# Altium project RTM_SFP.PrjPcb (part 1 of 2)
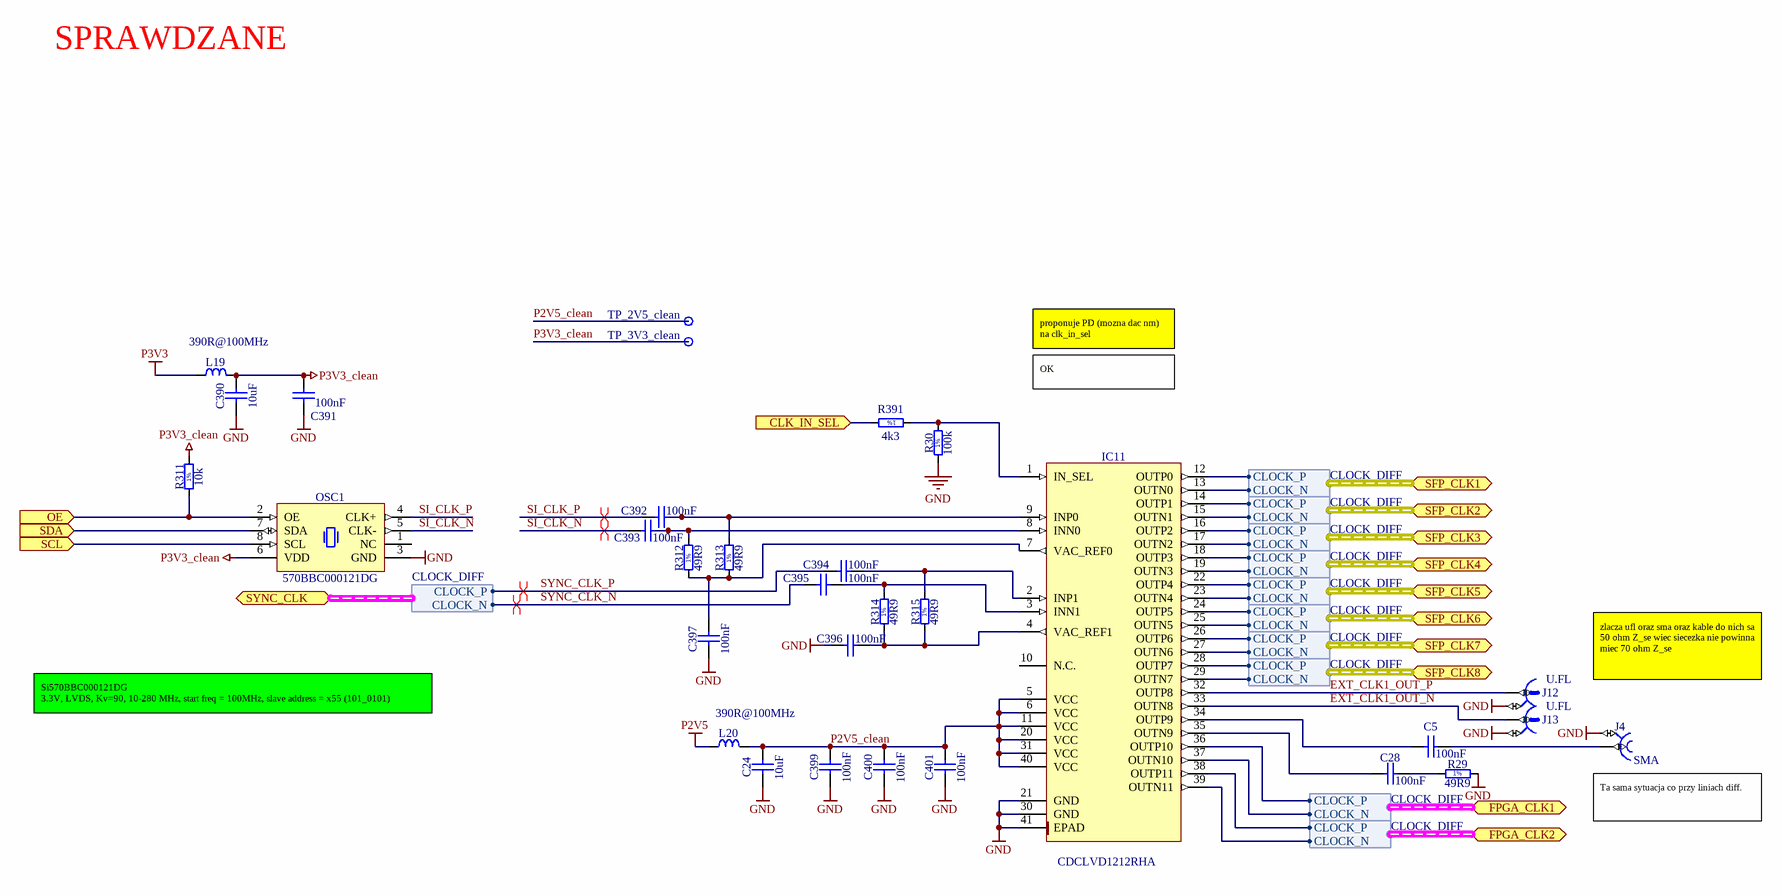
[diagram p0: Clock_Distribution.SchDoc]
7 sheets, 188 parts. Net scope: flat (ports and power ports of the same name join across sheets).
Board file: RTM_SFP.PcbDoc
Sheets:
  Clock_Distribution.SchDoc
  I2C_Switch.SchDoc
  PWR.SchDoc
  RTM_Connectors.SchDoc
  Serial_Registers.SchDoc
  SFP.SchDoc
  USR_IO_IPMI.SchDoc

## Sheet Clock_Distribution.SchDoc: Clock Distribution
size 420 x 297 mm; Organization: Altium Limited; Address1: L3, 12a Rodborough Rd; Address2: Frenchs Forest; Address3: NSW; Address4: Australia 2086; SheetNumber: 1; SheetTotal: 8

### Parts
C5  100nF  [CAPC1005X55N]
C24  10uF  [CAPC2012X135N]
C28  100nF  [CAPC1005X55N]
C390  10uF  [CAPC2012X135N]
C391  100nF  [CAPC0603X33N]
C392  100nF  [CAPC0603X33N]
C393  100nF  [CAPC0603X33N]
C394  100nF  [CAPC0603X33N]
C395  100nF  [CAPC0603X33N]
C396  100nF  [CAPC0603X33N]
C397  100nF  [CAPC0603X33N]
C399  100nF  [CAPC0603X33N]
C400  100nF  [CAPC0603X33N]
C401  100nF  [CAPC0603X33N]
IC11  CDCLVD1212RHA  [QFN50P600X600X80-41N-S425]
J4  SMA  [HUBER-SUHNER_85_SMA-50-0-101/111_NE]
J12  U.FL  [HIROSE_U.FL-R-SMT-1(10)]
J13  U.FL  [HIROSE_U.FL-R-SMT-1(10)]
L19  390R@100MHz  [INDC1608X95N]
L20  390R@100MHz  [INDC1608X95N]
OSC1  570BBC000121DG  [OSC_SILICON-LAB_SI570]
R29  49R9  [RESC1005X40N]
R30  100k  [RESC1608X55N]
R311  10k  [RESC1005X40N]
R312  49R9  [RESC1005X40N]
R313  49R9  [RESC1005X40N]
R314  49R9  [RESC1005X40N]
R315  49R9  [RESC1005X40N]
R391  4k3  [RESC1608X55N]
TP_2V5_clean  Test Point  [TPS127]  (value not drawn)
TP_3V3_clean  Test Point  [TPS127]  (value not drawn)

### Ports
CLK_IN_SEL (in), FPGA_CLK1 (harness CLOCK_DIFF), FPGA_CLK2 (harness CLOCK_DIFF), OE (in), SCL (in), SDA (in), SFP_CLK1 (harness CLOCK_DIFF), SFP_CLK2 (harness CLOCK_DIFF), SFP_CLK3 (harness CLOCK_DIFF), SFP_CLK4 (harness CLOCK_DIFF), SFP_CLK5 (harness CLOCK_DIFF), SFP_CLK6 (harness CLOCK_DIFF), SFP_CLK7 (harness CLOCK_DIFF), SFP_CLK8 (harness CLOCK_DIFF), SYNC_CLK (harness CLOCK_DIFF)

### Harnesses
CLOCK_DIFF: CLOCK_P, CLOCK_N

### Nets
GND: C24.1 C390.1 C391.1 C396.1 C397.1 C399.1 C400.1 C401.1 IC11.21(GND) IC11.30(GND) IC11.41(EPAD) J4.2 J12.2 J13.2 OSC1.3(GND) R29.2 R30.1
P2V5: L20.1
P3V3: L19.1
P3V3_clean: C390.2 C391.2 L19.2 OSC1.6(VDD) R311.2 TP_3V3_clean.1
EXT_CLK1_OUT_N: IC11.33(OUTN8) J13.1
EXT_CLK1_OUT_P: IC11.32(OUTP8) J12.1
FPGA_CLK1_N: IC11.37(OUTN10) ; port FPGA_CLK1.CLOCK_N
FPGA_CLK1_P: IC11.36(OUTP10) ; port FPGA_CLK1.CLOCK_P
FPGA_CLK2_N: IC11.39(OUTN11) ; port FPGA_CLK2.CLOCK_N
FPGA_CLK2_P: IC11.38(OUTP11) ; port FPGA_CLK2.CLOCK_P
P2V5_clean: C24.2 C399.2 C400.2 C401.2 IC11.5(VCC) IC11.6(VCC) IC11.11(VCC) IC11.20(VCC) IC11.31(VCC) IC11.40(VCC) L20.2 TP_2V5_clean.1
RTM_IO8: R391.2 ; port CLK_IN_SEL
RTM_IO9: OSC1.2(OE) R311.1 ; port OE
SI_CLK_N: C393.2 OSC1.5(CLK-)
SI_CLK_P: C392.2 OSC1.4(CLK+)
SYNC_CLK_N: C395.2 ; port SYNC_CLK.CLOCK_N
SYNC_CLK_P: C394.2 ; port SYNC_CLK.CLOCK_P
NetC5_1: C5.1 IC11.34(OUTP9)
NetC5_2: C5.2 J4.1
NetC28_1: C28.1 R29.1
NetC28_2: C28.2 IC11.35(OUTN9)
NetC392_1: C392.1 IC11.9(INP0) R313.2
NetC393_1: C393.1 IC11.8(INN0) R312.2
NetC394_1: C394.1 IC11.2(INP1) R315.2
NetC395_1: C395.1 IC11.3(INN1) R314.2
NetC396_2: C396.2 IC11.4(VAC_REF1) R314.1 R315.1
NetC397_2: C397.2 IC11.7(VAC_REF0) R312.1 R313.1
NetIC11_1: IC11.1(IN_SEL) R30.2 R391.1
NetIC11_12: IC11.12(OUTP0) ; port SFP_CLK1.CLOCK_P
NetIC11_13: IC11.13(OUTN0) ; port SFP_CLK1.CLOCK_N
NetIC11_14: IC11.14(OUTP1) ; port SFP_CLK2.CLOCK_P
NetIC11_15: IC11.15(OUTN1) ; port SFP_CLK2.CLOCK_N
NetIC11_16: IC11.16(OUTP2) ; port SFP_CLK3.CLOCK_P
NetIC11_17: IC11.17(OUTN2) ; port SFP_CLK3.CLOCK_N
NetIC11_18: IC11.18(OUTP3) ; port SFP_CLK4.CLOCK_P
NetIC11_19: IC11.19(OUTN3) ; port SFP_CLK4.CLOCK_N
NetIC11_22: IC11.22(OUTP4) ; port SFP_CLK5.CLOCK_P
NetIC11_23: IC11.23(OUTN4) ; port SFP_CLK5.CLOCK_N
NetIC11_24: IC11.24(OUTP5) ; port SFP_CLK6.CLOCK_P
NetIC11_25: IC11.25(OUTN5) ; port SFP_CLK6.CLOCK_N
NetIC11_26: IC11.26(OUTP6) ; port SFP_CLK7.CLOCK_P
NetIC11_27: IC11.27(OUTN6) ; port SFP_CLK7.CLOCK_N
NetIC11_28: IC11.28(OUTP7) ; port SFP_CLK8.CLOCK_P
NetIC11_29: IC11.29(OUTN7) ; port SFP_CLK8.CLOCK_N
NetIC12_1: OSC1.7(SDA) ; port SDA
NetIC12_2: OSC1.8(SCL) ; port SCL

Not connected (* = marked no-connect by the designer): IC11 10(N.C.); OSC1 1(NC)

### Layout directives
differential pair: SI_CLK_N, SI_CLK_P, SYNC_CLK_N, SYNC_CLK_P

### Notes on the sheet
- SPRAWDZANE
- proponuje PD (mozna dac nm) na clk_in_sel
- OK
- Si570BBC000121DG
  3.3V, LVDS, Kv=90, 10-280 MHz, start freq = 100MHz, slave address = x55 (101_0101)
- zlacza ufl oraz sma oraz kable do nich sa 50 ohm Z_se wiec siecezka nie powinna miec 70 ohm Z_se
- (near J4) Ta sama sytuacja co przy liniach diff.
- Project/Equipment
- Document
- uTCA RTM 8 SFP+
- Designer
- Drawn by
- Check.by
- Copyright Creotech Instruments SA 2014.
  This documentation describes Open Hardware and is licensed under the CERN OHL v.1.1. You may redistribute and modify this documentation under the terms of the CERN OHL v.1.1. (http://ohwr.org/CERNOHL). This documentation is distributed WITHOUT ANY EXPRESS OR IMPLIED WARRANTY, INCLUDING OF MERCHANTABILITY, SATISFACTORY QUALITY AND FITNESS FOR A PARTICULAR PURPOSE. Please see the CERN OHL v.1.1 for applicable conditions.
- Creotech Instruments S.A.
- File
- Last Mod.
- Print Date
- Sheet
- Size
- A3
- of
- Rev
- (in symbol R0402_10K_1%_0.0625W_100PPM) 1%
- (in symbol R0402_49R9_1%_0.0625W_100PPM) 1%
- (in symbol R0603_4K3_1%_0.1W_100PPM) 1%
- (in symbol R0603_100K_1%_0.1W_100PPM) 1%

### Library data of the parts
C5 C28 = CC0402_100NF_16V_10%_X7R: Non-polarised capacitor; Part Description: SMD Multilayer Chip Ceramic Capacitor; Manufacturer: GENERIC; Manufacturer1 Part Number: 223878715649; Voltage: 16V; TC: X7R; Tolerance: ±10%; Table: Capacitors SMD; Part Number: CC0402_100NF_16V_10%_X7R; Component Kind: Standard; Component Type: Standard; Pin Count: 2; Value: 100nF; Status: Not Recommended; Manufacturer Part Number: CC0402_100NF_16V_10%_X7R; Case: 0402; Mounted: Yes; Socket: No; SMD: Yes; Manufacturer1 Example: PHYCOMP; Manufacturer1 ComponentHeight: 0.55mm; HelpURL: \\cern.ch\dfs\Applications\Altium\Datasheets\CC0402_X7R_PHYCOMP.pdf; Author: CERN DEM JLC; CreateDate: 12/3/2007; LatestRevisionDate: 12/3/2007
C24 C390 = CC0805_10UF_10V_10%_X7R: Non-polarised capacitor; Part Description: SMD Multilayer Chip Ceramic Capacitor; Manufacturer: GENERIC; Manufacturer1 Part Number: GRM21BR71A106KE51L; Voltage: 10V; TC: X7R; Tolerance: ±10%; Table: Capacitors SMD; Part Number: CC0805_10UF_10V_10%_X7R; Component Kind: Standard; Component Type: Standard; Pin Count: 2; Value: 10uF; Status: Preferred; Manufacturer Part Number: CC0805_10UF_10V_10%_X7R; Case: 0805; Mounted: Yes; Socket: No; SMD: Yes; Manufacturer1 Example: MURATA; Manufacturer1 ComponentHeight: 1.35mm; HelpURL: \\cern.ch\dfs\Applications\Altium\Datasheets\CC0805_X7R_MURATA.pdf; Author: CERN DEM JLC; CreateDate: 2012-04-30; LatestRevisionDate: 2012-04-30
C391-C397 C399-C401 = CC0201_100NF_6.3V_10%_X5R: Non-polarised capacitor; Part Description: SMD Multilayer Chip Ceramic Capacitor; Manufacturer: GENERIC; Manufacturer1 Part Number: 02016D104KAT2A; Voltage: 6.3V; TC: X5R; Tolerance: ±10%; Table: Capacitors SMD; Part Number: CC0201_100NF_6.3V_10%_X5R; Component Kind: Standard; Component Type: Standard; Pin Count: 2; Value: 100nF; Status: Not Recommended; Manufacturer Part Number: CC0201_100NF_6.3V_10%_X5R; Case: 0201; Mounted: Yes; Socket: No; SMD: Yes; Manufacturer1 Example: AVX; Manufacturer1 ComponentHeight: 0.33mm; HelpURL: \\cern.ch\dfs\Applications\Altium\Datasheets\CC0201_X5R_AVX.pdf; Author: CERN DEM JLC; CreateDate: 2007-12-03; LatestRevisionDate: 2007-12-03
IC11 = CDCLVD1212RHA: 2:16 Low Additive Jitter LVDS Buffer; Part Description: 2:12 Low Additive Jitter LVDS Buffer; Manufacturer: TEXAS INSTRUMENTS; PressFit: No; Bonding: No; Part Number: CDCLVD1212RHA; Component Kind: Standard; Component Type: Standard; Device: CDCLVD1212RHA; PackageDescription: QFN, 0.50mm Pitch, Square; 40 Pin, 6.00mm L X 6.00mm W X 0.80mm H body (w/Thermal Tab 4.25 x 4.25mm), IPC Medium Density; Manufacturer Part Number: CDCLVD1212RHA; Pin Count: 41; Case: VQFN40; Mounted: Yes; Socket: No; SMD: Yes; Sense: No; ComponentHeight: 1mm; Author: LNLS DIG LOS; CreateDate: 03/02/2017; LatestRevisionDate: 03/02/2017
J4 = HUBER-SUHNER_85_SMA-50-0-101/111_NE: Part Description: SMA 50 Ohms Right Angle PCB Jack; Manufacturer: HUBER+SUHNER; PressFit: No; Part Number: HUBER-SUHNER_85_SMA-50-0-101/111_NE; Component Kind: Standard; Component Type: Standard; Footprint: HUBER-SUHNER_85 SMA-50-0-101/111_NE; Pin Count: 2; Family: SMA; Mounted: Yes; Socket: No; SMD: No; Sense: No; Status: None; Manufacturer Part Number: 85_SMA-50-0-101/111_NE; ComponentHeight: 9.6mm; HelpURL: \\cern.ch\dfs\Applications\Altium\Datasheets\HUBER-SUHNER_85_SMA-50-0-101-111_NE.pdf; Author: CERN DEM JLC; CreateDate: 20/04/2010; LatestRevisionDate: 06/11/2014
J12 J13 = HIROSE_U.FL-R-SMT-1(10): Part Description: Up to 6GHz Ultra Small Surface Mount Male Coaxial Connectors U.FL Series; Manufacturer: HIROSE (HRS); Table: Miscellaneous; PressFit: No; Part Number: HIROSE_U.FL-R-SMT-1(10); Component Kind: Standard; Component Type: Standard; Pin Count: 2; Family: U.FL; Mounted: Yes; Socket: No; SMD: Yes; Status: None; Manufacturer Part Number: U.FL-R-SMT-1(10); ComponentHeight: 1.25mm; HelpURL: \\cern.ch\dfs\Applications\Altium\Datasheets\HIROSE_U.FL-R-SMT-1(10).pdf; Author: CERN DEM JLC; CreateDate: 24/03/2010; LatestRevisionDate: 24/03/2010; Sense: No
L19 L20 = IND0603_TDK_MPZ1608R391A: Inductor; Part Description: SMT Chip Bead for Power Line; Manufacturer: TDK; Power: 1.2A; Resistance: 0.12R; Tolerance: ±25%; Table: Inductors SMD; Part Number: IND0603_TDK_MPZ1608R391A; Component Kind: Standard; Component Type: Standard; Pin Count: 2; Value: 390R@100MHz; Status: None; Manufacturer Part Number: MPZ1608R391A; Case: 0603; Mounted: Yes; Socket: No; SMD: Yes; ComponentHeight: 0.95mm; HelpURL: \\cern.ch\dfs\Applications\Altium\Datasheets\IND0603_TDK_MPZ1608.pdf; Author: CERN DEM JLC; CreateDate: 2009-12-02; LatestRevisionDate: 2009-12-02
OSC1 = OSC_10-280MHZ_SILICON-LAB_Si570BBC000121DG: Any-Rate I2C Programmable XO Oscillator Si570 Serie; Part Description: 10-280MHz 3.3V ±20ppm LVDS Any-Rate I2C Programmable XO Oscillator Si570 Serie; Manufacturer: SILICON LABS; Value: 100MHz; Table: Crystals & Oscillators; Part Number: OSC_10-280MHZ_SILICON-LAB_Si570BBC000121DG; Component Kind: Standard; Component Type: Standard; PackageDescription: Oscillator Si570 Serie, 8 pins, 5x7mm; Manufacturer Part Number: 570BBC000121DG; Pin Count: 8; Mounted: Yes; Socket: No; SMD: Yes; ComponentHeight: 1.85mm; HelpURL: \\cern.ch\dfs\Applications\Altium\Datasheets\OSC_SILICON-LAB_SI570.pdf; Author: CERN DEM JLC; CreateDate: 2010-02-09; LatestRevisionDate: 2012-03-26
R29 R312-R315 = R0402_49R9_1%_0.0625W_100PPM: Resistor - 1%; Part Description: General Purpose Thick Film Chip Resistor; Manufacturer: GENERIC; Manufacturer1 Part Number: 232270674999L or RC0402FR-0749R9L; TC: ±100ppm/°C; Table: Resistors SMD; Part Number: R0402_49R9_1%_0.0625W_100PPM; Component Kind: Standard; Component Type: Standard; Pin Count: 2; Value: 49R9; Status: Not recommended; Power: 0.0625W; Tolerance: ±1%; Manufacturer Part Number: R0402_49R9_1%_0.0625W_100PPM; Case: 0402; Mounted: Yes; Socket: No; SMD: Yes; Manufacturer1 Example: YAGEO PHYCOMP; Manufacturer1 ComponentHeight: 0.4mm; HelpURL: \\cern.ch\dfs\Applications\Altium\Datasheets\R0402_Phycomp_RC0402.pdf; Author: CERN DEM JLC; CreateDate: 2012-10-24; LatestRevisionDate: 2012-10-24
R30 = R0603_100K_1%_0.1W_100PPM: Resistor - 1%; Part Description: General Purpose Thick Film Chip Resistor; Manufacturer: GENERIC; Manufacturer1 Part Number: NRC06F1003TRF; Power: 0.1W; TC: ±100ppm/°C; Part Number: R0603_100K_1%_0.1W_100PPM; Component Kind: Standard; Component Type: Standard; Pin Count: 2; Value: 100k; Status: Preferred; Tolerance: ±1%; Manufacturer Part Number: R0603_100K_1%_0.1W_100PPM; Case: 0603; Mounted: Yes; Socket: No; SMD: Yes; Manufacturer1 Example: NIC COMPONENT; Manufacturer1 ComponentHeight: 0.55mm; HelpURL: \\cern.ch\dfs\Applications\Altium\Datasheets\R0603_NIC_NRC.pdf; Author: CERN DEM JLC; CreateDate: 03/12/2007; LatestRevisionDate: 13/03/2008; Sense: No
R311 = R0402_10K_1%_0.0625W_100PPM: Resistor - 1%; Part Description: General Purpose Thick Film Chip Resistor; Manufacturer: GENERIC; Manufacturer1 Part Number: 232270671003L; TC: ±100ppm/°C; Table: Resistors SMD; Part Number: R0402_10K_1%_0.0625W_100PPM; Component Kind: Standard; Component Type: Standard; Pin Count: 2; Value: 10k; Status: Not recommended; Power: 0.0625W; Tolerance: ±1%; Manufacturer Part Number: R0402_10K_1%_0.0625W_100PPM; Case: 0402; Mounted: Yes; Socket: No; SMD: Yes; Manufacturer1 Example: YAGEO PHYCOMP; Manufacturer1 ComponentHeight: 0.4mm; HelpURL: \\cern.ch\dfs\Applications\Altium\Datasheets\R0402_Phycomp_RC0402.pdf; Author: CERN DEM JLC; CreateDate: 2007-12-03; LatestRevisionDate: 2012-10-17
R391 = R0603_4K3_1%_0.1W_100PPM: Resistor - 1%; Part Description: General Purpose Thick Film Chip Resistor; Manufacturer: GENERIC; Manufacturer1 Part Number: NRC06F4301TRF; Power: 0.1W; TC: ±100ppm/°C; Table: Resistors SMD; Part Number: R0603_4K3_1%_0.1W_100PPM; Component Kind: Standard; Component Type: Standard; Pin Count: 2; Value: 4k3; Status: Preferred; Tolerance: ±1%; Manufacturer Part Number: R0603_4K3_1%_0.1W_100PPM; Mounted: Yes; Socket: No; SMD: Yes; Manufacturer1 Example: NIC COMPONENT; Manufacturer1 ComponentHeight: 0.55mm; HelpURL: \\cern.ch\dfs\Applications\Altium\Datasheets\R0603_NIC_NRC.pdf; Author: CERN DEM JLC; CreateDate: 2007-12-03; LatestRevisionDate: 2008-03-13
TP_2V5_clean TP_3V3_clean = SMD_PAD_1.27X1.27MM: Part Description: 1.27mm x 1.27mm PCB Copper Area (SMD Test Point); Mounted: No; Part Number: SMD_PAD_1.27X1.27MM; Component Kind: Standard (No BOM); Component Type: Standard (No BOM); Pin Count: 1; Family: Test Point; Socket: No; SMD: Yes; Sense: No; Status: None; ComponentHeight: 0mm; HelpURL: Undefined; Author: CERN DEM JLC; CreateDate: 12/01/2008; LatestRevisionDate: 12/01/2008; PackageDescription: 1.27mm x 1.27mm PCB Copper Area (SMD Test Point)

## Sheet I2C_Switch.SchDoc: I2C Switch
size 420 x 297 mm; Organization: Altium Limited; Address1: L3, 12a Rodborough Rd; Address2: Frenchs Forest; Address3: NSW; Address4: Australia 2086; SheetNumber: 2; SheetTotal: 8
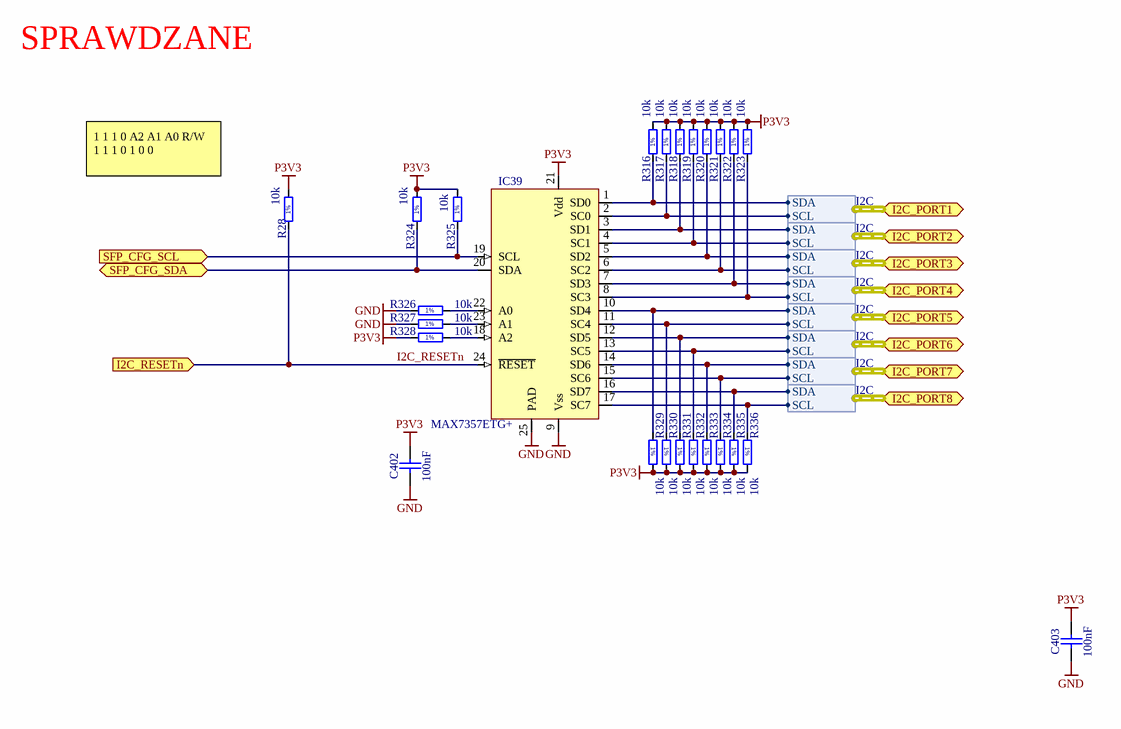
[diagram p1: I2C_Switch.SchDoc]

### Parts
C402  100nF  [CAPC0603X33N]
C403  100nF  [CAPC0603X33N]
IC39  MAX7357ETG+  [QFN50P400X400X80-25N-S265]
R28  10k  [RESC1005X40N]
R316  10k  [RESC1005X40N]
R317  10k  [RESC1005X40N]
R318  10k  [RESC1005X40N]
R319  10k  [RESC1005X40N]
R320  10k  [RESC1005X40N]
R321  10k  [RESC1005X40N]
R322  10k  [RESC1005X40N]
R323  10k  [RESC1005X40N]
R324  10k  [RESC1005X40N]
R325  10k  [RESC1005X40N]
R326  10k  [RESC1005X40N]
R327  10k  [RESC1005X40N]
R328  10k  [RESC1005X40N]
R329  10k  [RESC1005X40N]
R330  10k  [RESC1005X40N]
R331  10k  [RESC1005X40N]
R332  10k  [RESC1005X40N]
R333  10k  [RESC1005X40N]
R334  10k  [RESC1005X40N]
R335  10k  [RESC1005X40N]
R336  10k  [RESC1005X40N]

### Ports
I2C_PORT1 (harness I2C), I2C_PORT2 (harness I2C), I2C_PORT3 (harness I2C), I2C_PORT4 (harness I2C), I2C_PORT5 (harness I2C), I2C_PORT6 (harness I2C), I2C_PORT7 (harness I2C), I2C_PORT8 (harness I2C), I2C_RESETn (in), SFP_CFG_SCL (in), SFP_CFG_SDA (bidir)

### Harnesses
I2C: SCL, SDA

### Nets
GND: C402.1 C403.1 IC39.9(Vss) IC39.25(PAD) R326.1 R327.1
P3V3: C402.2 C403.2 IC39.21(Vdd) R28.2 R316.2 R317.2 R318.2 R319.2 R320.2 R321.2 R322.2 R323.2 R324.2 R325.2 R328.1 R329.2 R330.2 R331.2 R332.2 R333.2 R334.2 R335.2 R336.2
I2C_RESETn: IC39.24(~{RESET}) R28.1 ; port I2C_RESETn
NetIC17_1: IC39.19(SCL) R325.1 ; port SFP_CFG_SCL
NetIC17_8: IC39.20(SDA) R324.1 ; port SFP_CFG_SDA
NetIC39_1: IC39.1(SD0) R316.1 ; port I2C_PORT1.SDA
NetIC39_2: IC39.2(SC0) R317.1 ; port I2C_PORT1.SCL
NetIC39_3: IC39.3(SD1) R318.1 ; port I2C_PORT2.SDA
NetIC39_4: IC39.4(SC1) R319.1 ; port I2C_PORT2.SCL
NetIC39_5: IC39.5(SD2) R320.1 ; port I2C_PORT3.SDA
NetIC39_6: IC39.6(SC2) R321.1 ; port I2C_PORT3.SCL
NetIC39_7: IC39.7(SD3) R322.1 ; port I2C_PORT4.SDA
NetIC39_8: IC39.8(SC3) R323.1 ; port I2C_PORT4.SCL
NetIC39_10: IC39.10(SD4) R329.1 ; port I2C_PORT5.SDA
NetIC39_11: IC39.11(SC4) R330.1 ; port I2C_PORT5.SCL
NetIC39_12: IC39.12(SD5) R331.1 ; port I2C_PORT6.SDA
NetIC39_13: IC39.13(SC5) R332.1 ; port I2C_PORT6.SCL
NetIC39_14: IC39.14(SD6) R333.1 ; port I2C_PORT7.SDA
NetIC39_15: IC39.15(SC6) R334.1 ; port I2C_PORT7.SCL
NetIC39_16: IC39.16(SD7) R335.1 ; port I2C_PORT8.SDA
NetIC39_17: IC39.17(SC7) R336.1 ; port I2C_PORT8.SCL
NetIC39_18: IC39.18(A2) R328.2
NetIC39_22: IC39.22(A0) R326.2
NetIC39_23: IC39.23(A1) R327.2

### Notes on the sheet
- SPRAWDZANE
- 1 1 1 0 A2 A1 A0 R/W
  1 1 1 0 1 0 0
- Project/Equipment
- Document
- uTCA RTM 8 SFP+
- Designer
- Drawn by
- Check.by
- Copyright Creotech Instruments SA 2014.
  This documentation describes Open Hardware and is licensed under the CERN OHL v.1.1. You may redistribute and modify this documentation under the terms of the CERN OHL v.1.1. (http://ohwr.org/CERNOHL). This documentation is distributed WITHOUT ANY EXPRESS OR IMPLIED WARRANTY, INCLUDING OF MERCHANTABILITY, SATISFACTORY QUALITY AND FITNESS FOR A PARTICULAR PURPOSE. Please see the CERN OHL v.1.1 for applicable conditions.
- Creotech Instruments S.A.
- File
- Last Mod.
- Print Date
- Sheet
- Size
- A3
- of
- Rev
- (in symbol R0402_10K_1%_0.0625W_100PPM) 1%

### Library data of the parts
C402 C403 = CC0201_100NF_6.3V_10%_X5R: as C391 on sheet Clock_Distribution; Part Number: CC0201_100NF_6.3V_10%_X5R; Component Kind: Standard; Component Type: Standard; Pin Count: 2; Value: 100nF; Status: Not Recommended; Manufacturer Part Number: CC0201_100NF_6.3V_10%_X5R; Case: 0201; Mounted: Yes; Socket: No; SMD: Yes; Manufacturer1 Example: AVX; Manufacturer1 ComponentHeight: 0.33mm; HelpURL: \\cern.ch\dfs\Applications\Altium\Datasheets\CC0201_X5R_AVX.pdf; Author: CERN DEM JLC; CreateDate: 2007-12-03; LatestRevisionDate: 2007-12-03
IC39 = MAX7357ETG+: 8-channel I2C-bus multiplexer with reset, INT and timeout; Part Description: 1-to8 I2C Bus Switch/Multiplexer with Bus Lock-Up Detection, Isolation, and Notification; Manufacturer: MAXIM; PressFit: No; Bonding: No; Part Number: MAX7357ETG+; Component Kind: Standard; Component Type: Standard; Device: MAX7357ETG+; PackageDescription: QFN, 0.50mm Pitch, Square; 6 Pin X 6 Pin, 4mm X 4mm Body (w/Thermal Tab 2.65 X 2.65 mm), IPC Medium Density; Manufacturer Part Number: MAX7357ETG+; Pin Count: 25; Case: TQFN-EP; Mounted: Yes; Socket: No; SMD: Yes; Sense: No; ComponentHeight: 0.8mm; Author: LNLS DIG GBMB; CreateDate: 04/02/2017; LatestRevisionDate: 04/02/2017
R28 R316-R336 = R0402_10K_1%_0.0625W_100PPM: as R311 on sheet Clock_Distribution; Part Number: R0402_10K_1%_0.0625W_100PPM; Component Kind: Standard; Component Type: Standard; Pin Count: 2; Value: 10k; Status: Not recommended; Power: 0.0625W; Tolerance: ±1%; Manufacturer Part Number: R0402_10K_1%_0.0625W_100PPM; Case: 0402; Mounted: Yes; Socket: No; SMD: Yes; Manufacturer1 Example: YAGEO PHYCOMP; Manufacturer1 ComponentHeight: 0.4mm; HelpURL: \\cern.ch\dfs\Applications\Altium\Datasheets\R0402_Phycomp_RC0402.pdf; Author: CERN DEM JLC; CreateDate: 2007-12-03; LatestRevisionDate: 2012-10-17

## Sheet PWR.SchDoc: PWR
size 420 x 297 mm; Organization: Altium Limited; Address1: L3, 12a Rodborough Rd; Address2: Frenchs Forest; Address3: NSW; Address4: Australia 2086; SheetNumber: 3; SheetTotal: 8
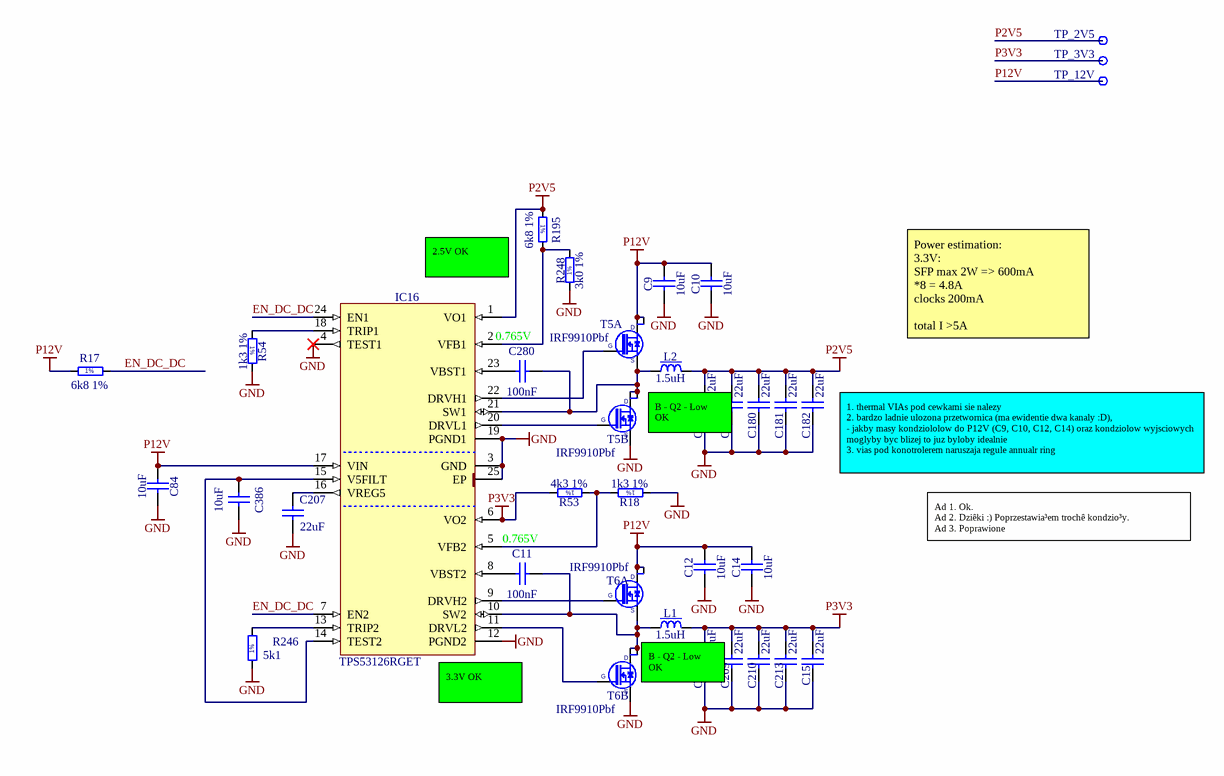
[diagram p2: PWR.SchDoc]

### Parts
C9  10uF  [CAPC2012X135N]
C10  10uF  [CAPC2012X135N]
C11  100nF  [CAPC1005X55N]
C12  10uF  [CAPC2012X135N]
C14  10uF  [CAPC2012X135N]
C15  22uF  [CAPC3216X180N]
C84  10uF  [CAPC2012X135N]
C176  22uF  [CAPC3216X180N]
C179  22uF  [CAPC3216X180N]
C180  22uF  [CAPC3216X180N]
C181  22uF  [CAPC3216X180N]
C182  22uF  [CAPC3216X180N]
C207  22uF  [CAPC3216X180N]
C208  22uF  [CAPC3216X180N]
C209  22uF  [CAPC3216X180N]
C210  22uF  [CAPC3216X180N]
C213  22uF  [CAPC3216X180N]
C280  100nF  [CAPC1005X55N]
C386  10uF  [CAPC2012X135N]
IC16  TPS53126RGET  [QFN50P400X400X100-25N-S255]
L1  1.5uH  [INDM6965X300N]
L2  1.5uH  [INDM6965X300N]
R17  6k8 1%  [RESC1608X55N]
R18  1k3 1%  [RESC1608X55N]
R53  4k3 1%  [RESC1608X55N]
R54  1k3 1%  [RESC1608X55N]
R195  6k8 1%  [RESC1608X55N]
R246  5k1  [RESC1608X55N]
R248  3k0 1%  [RESC1608X55N]
T5  IRF9910Pbf  [SOIC127P600X175-8N]  (parts A,B of 2)
T6  IRF9910Pbf  [SOIC127P600X175-8N]  (parts A,B of 2)
TP_2V5  Test Point  [TPS127]  (value not drawn)
TP_3V3  Test Point  [TPS127]  (value not drawn)
TP_12V  Test Point  [TPS127]  (value not drawn)

### Nets
GND: C9.1 C10.1 C12.1 C14.1 C15.1 C84.2 C176.1 C179.1 C180.1 C181.1 C182.1 C207.1 C208.1 C209.1 C210.1 C213.1 C386.1 IC16.3(GND) IC16.4(TEST1) IC16.12(PGND2) IC16.19(PGND1) IC16.25(EP) R18.1 R54.2 R246.1 R248.1 T5.1(S) T6.1(S)
P2V5: C176.2 C179.2 C180.2 C181.2 C182.2 IC16.1(VO1) L2.2 R195.1 TP_2V5.1
P3V3: C15.2 C208.2 C209.2 C210.2 C213.2 IC16.6(VO2) L1.2 R53.2 TP_3V3.1
P12V: C9.2 C10.2 C12.2 C14.2 C84.1 IC16.17(VIN) R17.1 T5.5(D) T5.6(D) T6.5(D) T6.6(D) TP_12V.1
EN_DC_DC: IC16.7(EN2) IC16.24(EN1) R17.2
NetC11_1: C11.1 IC16.10(SW2) L1.1 T6.3(S) T6.7(D) T6.8(D)
NetC11_2: C11.2 IC16.8(VBST2)
NetC207_2: C207.2 IC16.16(VREG5)
NetC280_1: C280.1 IC16.21(SW1) L2.1 T5.3(S) T5.7(D) T5.8(D)
NetC280_2: C280.2 IC16.23(VBST1)
NetC386_2: C386.2 IC16.14(TEST2) IC16.15(V5FILT)
NetIC16_2: IC16.2(VFB1) R195.2 R248.2
NetIC16_5: IC16.5(VFB2) R18.2 R53.1
NetIC16_9: IC16.9(DRVH2) T6.4(G)
NetIC16_11: IC16.11(DRVL2) T6.2(G)
NetIC16_13: IC16.13(TRIP2) R246.2
NetIC16_18: IC16.18(TRIP1) R54.1
NetIC16_20: IC16.20(DRVL1) T5.2(G)
NetIC16_22: IC16.22(DRVH1) T5.4(G)

### Notes on the sheet
- 2.5V OK
- 0.765V
- Power estimation:
  3.3V:
  SFP max 2W => 600mA
  *8 = 4.8A
  clocks 200mA
  total I >5A
- B - Q2 - Low
  OK
- (near C182) 1. thermal VIAs pod cewkami sie nalezy
  2. bardzo ladnie ulozona przetwornica (ma ewidentie dwa kanaly :D),
  - jakby masy kondziololow do P12V (C9, C10, C12, C14) oraz kondziolow wyjsciowych moglyby byc blizej to juz byloby idealnie
  3. vias pod konotrolerem naruszaja regule annualr ring
- Ad 1. Ok.
  Ad 2. Dziêki :) Poprzestawia³em trochê kondzio³y.
  Ad 3. Poprawione
- (near IC16) 3.3V OK
- Project/Equipment
- Document
- uTCA RTM 8 SFP+
- Designer
- Drawn by
- Check.by
- Copyright Creotech Instruments SA 2014.
  This documentation describes Open Hardware and is licensed under the CERN OHL v.1.1. You may redistribute and modify this documentation under the terms of the CERN OHL v.1.1. (http://ohwr.org/CERNOHL). This documentation is distributed WITHOUT ANY EXPRESS OR IMPLIED WARRANTY, INCLUDING OF MERCHANTABILITY, SATISFACTORY QUALITY AND FITNESS FOR A PARTICULAR PURPOSE. Please see the CERN OHL v.1.1 for applicable conditions.
- Creotech Instruments S.A.
- File
- Last Mod.
- Print Date
- Sheet
- Size
- A3
- of
- Rev
- (in symbol R0603_1K3_1%_0.1W_100PPM) 1%
- (in symbol R0603_3K_1%_0.1W_100PPM) 1%
- (in symbol R0603_4K3_1%_0.1W_100PPM) 1%
- (in symbol R0603_5K1_1%_0.1W_100PPM) 1%
- (in symbol R0603_6K8_1%_0.1W_100PPM) 1%

### Library data of the parts
C9 C10 C12 C14 C84 C386 = CC0805_10UF_10V_10%_X7R: Non-polarised capacitor; Part Description: SMD Multilayer Chip Ceramic Capacitor; Manufacturer: GENERIC; Manufacturer1 Part Number: GRM21BR71A106KE51L; Voltage: 10V; TC: X7R; Tolerance: ±10%; Part Number: CC0805_10UF_10V_10%_X7R; Component Kind: Standard; Component Type: Standard; Pin Count: 2; Value: 10uF; Status: Preferred; Manufacturer Part Number: CC0805_10UF_10V_10%_X7R; Case: 0805; Mounted: Yes; Socket: No; SMD: Yes; Manufacturer1 Example: MURATA; Manufacturer1 ComponentHeight: 1.35mm; HelpURL: \\cern.ch\dfs\Applications\Altium\Datasheets\CC0805_X7R_MURATA.pdf; Author: CERN DEM JLC; CreateDate: 30/04/2012; LatestRevisionDate: 30/04/2012; Sense: No
C11 C280 = CC0402_100NF_16V_10%_X7R: Non-polarised capacitor; Part Description: SMD Multilayer Chip Ceramic Capacitor; Manufacturer: GENERIC; Manufacturer1 Part Number: GRM155R71C104KA88D; Voltage: 16V; TC: X7R; Tolerance: ±10%; Part Number: CC0402_100NF_16V_10%_X7R; Component Kind: Standard; Component Type: Standard; Pin Count: 2; Value: 100nF; Status: Not Recommended; Manufacturer Part Number: CC0402_100NF_16V_10%_X7R; Case: 0402; Mounted: Yes; Socket: No; SMD: Yes; Manufacturer1 Example: MURATA; Manufacturer1 ComponentHeight: 0.55mm; HelpURL: \\cern.ch\dfs\Applications\Altium\Datasheets\CC0402_X7R_MURATA_GRM.pdf; Author: CERN DEM JLC; CreateDate: 05/12/2013; LatestRevisionDate: 03/12/2007; Sense: No
C15 C176 C179-C182 C207-C210 C213 = CC1206_22UF_10V_10%_X7R: Non-polarised capacitor; Part Description: SMD Multilayer Chip Ceramic Capacitor; Manufacturer: GENERIC; Manufacturer1 Part Number: GRM31CR71A226KE15L; Voltage: 10V; TC: X7R; Tolerance: ±10%; Table: Capacitors SMD; Part Number: CC1206_22UF_10V_10%_X7R; Component Kind: Standard; Component Type: Standard; Pin Count: 2; Value: 22uF; Status: Preferred; Manufacturer Part Number: CC1206_22UF_10V_10%_X7R; Case: 1206; Mounted: Yes; Socket: No; SMD: Yes; Manufacturer1 Example: MURATA; Manufacturer1 ComponentHeight: 1.8mm; HelpURL: \\cern.ch\dfs\Applications\Altium\Datasheets\CC1206_X7R_MURATA_GRM-HI-CAP.pdf; Author: CERN DEM JLC; CreateDate: 2010-06-08; LatestRevisionDate: 2010-06-08
IC16 = TPS53126RGET: Dual Synchronous Step-Down Controller For Low Voltage Power Rails; Manufacturer: TEXAS INSTRUMENTS; Table: Analog & Interface; Part Number: TPS53126RGET; Component Kind: Standard; Component Type: Standard; Device: TPS53126RGET; PackageDescription: QFN,0.50mm pitch,square;6 pin X 6 pin,4.15mm X 4.15mm X 1.00mm H body (w/thermal tab 2.55 X 2.55mm),  IPC Medium Density; Part Description: Dual Synchronous Step-Down Controller For Low Voltage Power Rails; Manufacturer Part Number: TPS53126RGET; Pin Count: 25; Case: QFN24; Mounted: Yes; Socket: No; SMD: Yes; ComponentHeight: 1.0mm; Author: CERN DEM JLC; HelpURL: \\cern.ch\dfs\Applications\Altium\Datasheets\TPS53126RGET.pdf; CreateDate: 2010-08-26; LatestRevisionDate: 2010-08-26
L1 L2 = IND2525_1.5UH_20%_VISHAY_IHLP-2525CZ: Inductor With Magnetic core; Part Description: Low Profile, High Current IHLP® Inductor; Manufacturer: VISHAY DALE; Manufacturer Part Number: IHLP2525CZER1R5M01; Power: 9A; Resistance: 0.014R; Tolerance: ±20%; Table: Inductors SMD; Part Number: IND2525_1.5UH_20%_VISHAY_IHLP-2525CZ; Component Kind: Standard; Component Type: Standard; Pin Count: 2; Value: 1.5uH; Status: None; Case: 2525; Mounted: Yes; Socket: No; SMD: Yes; ComponentHeight: 3mm; HelpURL: \\cern.ch\dfs\Applications\Altium\Datasheets\IND2525_VISHAY_IHLP-2525CZ.pdf; Author: CERN DEM JLC; CreateDate: 2012-10-24; LatestRevisionDate: 2012-10-24
R17 R195 = R0603_6K8_1%_0.1W_100PPM: Resistor - 1%; Part Description: General Purpose Thick Film Chip Resistor; Manufacturer: GENERIC; Manufacturer1 Part Number: NRC06F6801TRF; Power: 0.1W; TC: ±100ppm/°C; Table: Resistors SMD; Part Number: R0603_6K8_1%_0.1W_100PPM; Component Kind: Standard; Component Type: Standard; Pin Count: 2; Value: 6k8; Status: Preferred; Tolerance: ±1%; Manufacturer Part Number: R0603_6K8_1%_0.1W_100PPM; Case: 0603; Mounted: Yes; Socket: No; SMD: Yes; Manufacturer1 Example: NIC COMPONENT; Manufacturer1 ComponentHeight: 0.55mm; HelpURL: \\cern.ch\dfs\Applications\Altium\Datasheets\R0603_NIC_NRC.pdf; Author: CERN DEM JLC; CreateDate: 2007-12-03; LatestRevisionDate: 2008-03-13
R18 R54 = R0603_1K3_1%_0.1W_100PPM: Resistor - 1%; Part Description: General Purpose Thick Film Chip Resistor; Manufacturer: GENERIC; Manufacturer1 Part Number: NRC06F1301TRF; Power: 0.1W; TC: ±100ppm/°C; Table: Resistors SMD; Part Number: R0603_1K3_1%_0.1W_100PPM; Component Kind: Standard; Component Type: Standard; Pin Count: 2; Value: 1k3; Status: Preferred; Tolerance: ±1%; Manufacturer Part Number: R0603_1K3_1%_0.1W_100PPM; Case: 0603; Mounted: Yes; Socket: No; SMD: Yes; Manufacturer1 Example: NIC COMPONENT; Manufacturer1 ComponentHeight: 0.55mm; HelpURL: \\cern.ch\dfs\Applications\Altium\Datasheets\R0603_NIC_NRC.pdf; Author: CERN DEM JLC; CreateDate: 2007-12-03; LatestRevisionDate: 2008-03-13
R53 = R0603_4K3_1%_0.1W_100PPM: as R391 on sheet Clock_Distribution; Part Number: R0603_4K3_1%_0.1W_100PPM; Component Kind: Standard; Component Type: Standard; Pin Count: 2; Value: 4k3; Status: Preferred; Tolerance: ±1%; Manufacturer Part Number: R0603_4K3_1%_0.1W_100PPM; Case: 0603; Mounted: Yes; Socket: No; SMD: Yes; Manufacturer1 Example: NIC COMPONENT; Manufacturer1 ComponentHeight: 0.55mm; HelpURL: \\cern.ch\dfs\Applications\Altium\Datasheets\R0603_NIC_NRC.pdf; Author: CERN DEM JLC; CreateDate: 2007-12-03; LatestRevisionDate: 2008-03-13
R246 = R0603_5K1_1%_0.1W_100PPM: Resistor - 1%; Part Description: General Purpose Thick Film Chip Resistor; Manufacturer: GENERIC; Manufacturer1 Part Number: NRC06F5101TRF; Power: 0.1W; TC: ±100ppm/°C; Table: Resistors SMD; Part Number: R0603_5K1_1%_0.1W_100PPM; Component Kind: Standard; Component Type: Standard; Pin Count: 2; Value: 5k1; Status: Preferred; Tolerance: ±1%; Manufacturer Part Number: R0603_5K1_1%_0.1W_100PPM; Case: 0603; Mounted: Yes; Socket: No; SMD: Yes; Manufacturer1 Example: NIC COMPONENT; Manufacturer1 ComponentHeight: 0.55mm; HelpURL: \\cern.ch\dfs\Applications\Altium\Datasheets\R0603_NIC_NRC.pdf; Author: CERN DEM JLC; CreateDate: 2007-12-03; LatestRevisionDate: 2008-03-13
R248 = R0603_3K_1%_0.1W_100PPM: Resistor - 1%; Part Description: General Purpose Thick Film Chip Resistor; Manufacturer: GENERIC; Manufacturer1 Part Number: NRC06F3001TRF; Value: 3k; Power: 0.1W; TC: ±100ppm/°C; Table: Resistors SMD; Part Number: R0603_3K_1%_0.1W_100PPM; Component Kind: Standard; Component Type: Standard; Pin Count: 2; Status: Preferred; Tolerance: ±1%; Manufacturer Part Number: R0603_3K_1%_0.1W_100PPM; Case: 0603; Mounted: Yes; Socket: No; SMD: Yes; Manufacturer1 Example: NIC COMPONENT; Manufacturer1 ComponentHeight: 0.55mm; HelpURL: \\cern.ch\dfs\Applications\Altium\Datasheets\R0603_NIC_NRC.pdf; Author: CERN DEM JLC; CreateDate: 2007-12-03; LatestRevisionDate: 2008-03-13
T5 T6 = IRF9910Pbf: Dual SO-8 MOSFET For POL Cconverter; Part Description: 20V 10A(Q1) 20V 12A (Q2) Dual SO-8 MOSFET For POL Cconverter; Manufacturer: INTERNATIONAL RECTIFIER; Table: Transistors; Part Number: IRF9910Pbf; Component Kind: Standard; Component Type: Standard; Device: IRF9910Pbf; PackageDescription: SOIC 8, Pitch 1.27mm - Body 4x5mm, IPC Medium Density; Manufacturer Part Number: IRF9910Pbf; Pin Count: 8; Case: DO8; Mounted: Yes; Socket: No; SMD: Yes; ComponentHeight: 1.75mm; HelpURL: \\cern.ch\dfs\Applications\Altium\Datasheets\IRF9910Pbf.pdf; Author: CERN DEM JLC; CreateDate: 2010-08-30; LatestRevisionDate: 2010-08-30
TP_2V5 TP_3V3 TP_12V = SMD_PAD_1.27X1.27MM: as TP_2V5_clean on sheet Clock_Distribution; Part Number: SMD_PAD_1.27X1.27MM; Component Kind: Standard (No BOM); Component Type: Standard (No BOM); Pin Count: 1; Family: Test Point; Socket: No; SMD: Yes; Sense: No; Status: None; ComponentHeight: 0mm; HelpURL: Undefined; Author: CERN DEM JLC; CreateDate: 12/01/2008; LatestRevisionDate: 12/01/2008; PackageDescription: 1.27mm x 1.27mm PCB Copper Area (SMD Test Point)

## Sheet RTM_Connectors.SchDoc: RTM Connectors
size 420 x 297 mm; Organization: Altium Limited; Address1: L3, 12a Rodborough Rd; Address2: Frenchs Forest; Address3: NSW; Address4: Australia 2086; SheetNumber: 4; SheetTotal: 8
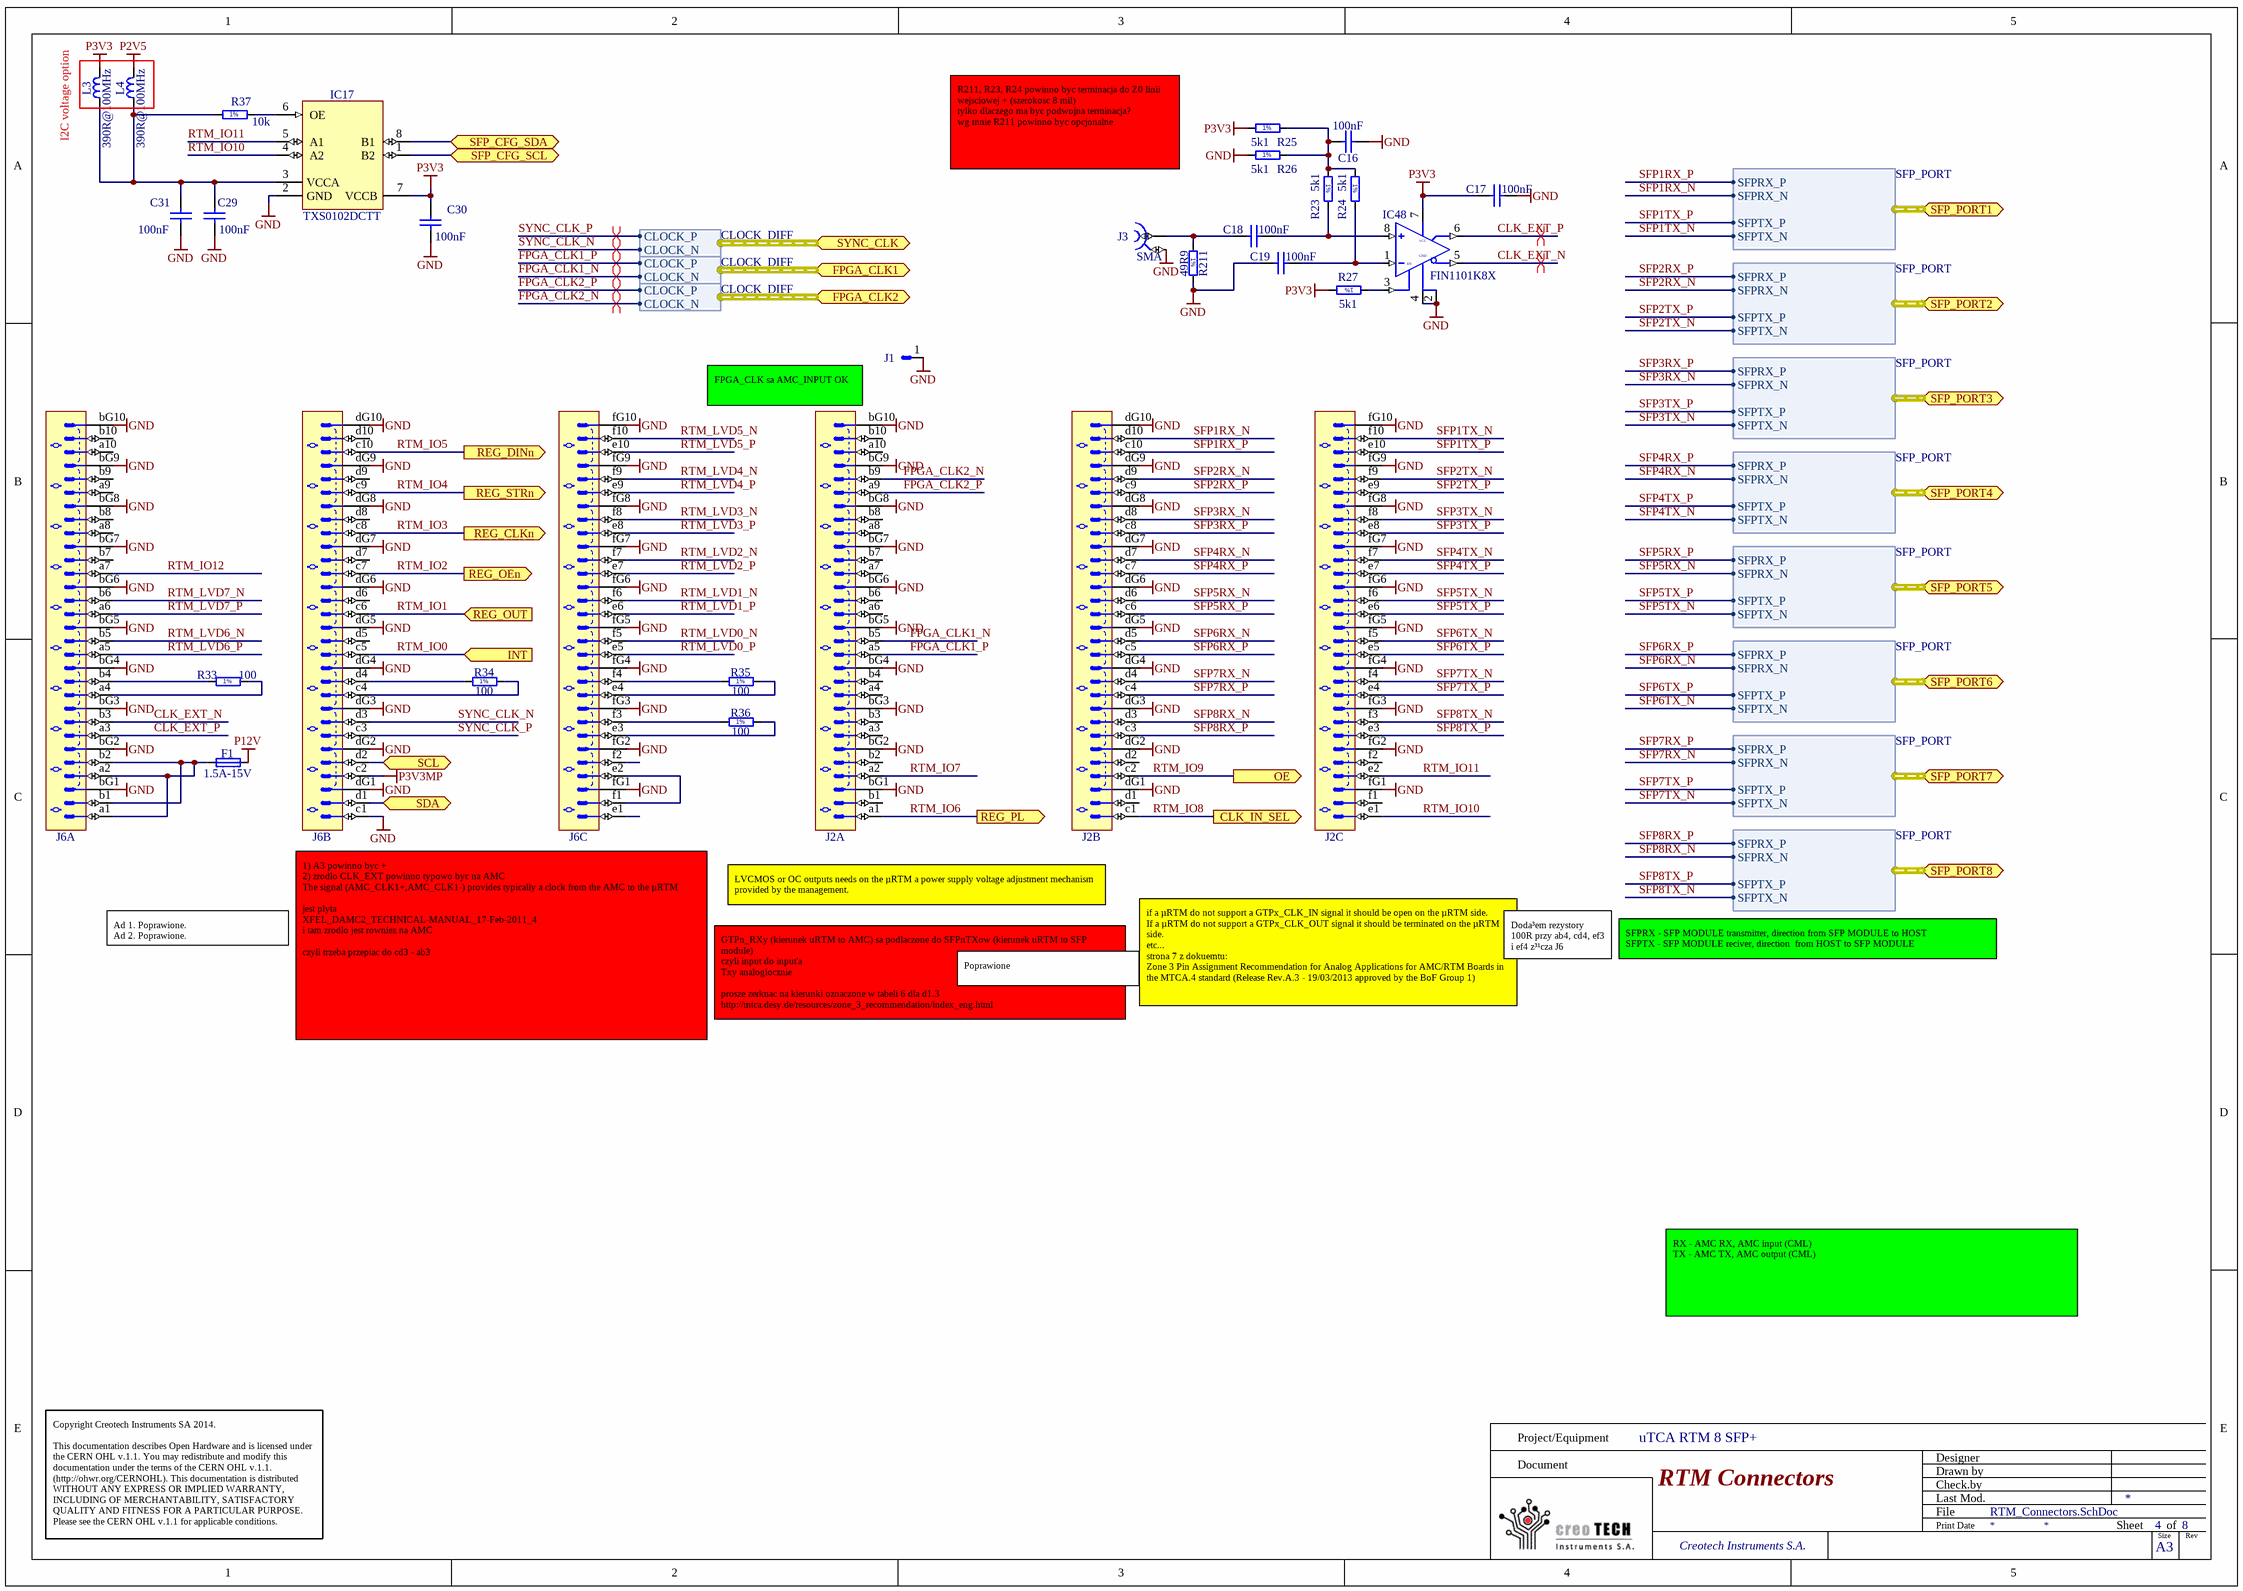
[diagram p3: RTM_Connectors.SchDoc]

### Parts
C16  100nF  [CAPC1005X55N]
C17  100nF  [CAPC1005X55N]
C18  100nF  [CAPC1005X55N]
C19  100nF  [CAPC1005X55N]
C29  100nF  [CAPC0603X33N]
C30  100nF  [CAPC0603X33N]
C31  100nF  [CAPC0603X33N]
F1  1.5A-15V  [FUSR_TYCO_SMD150F-2]
IC17  TXS0102DCTT  [SOP65P400X130-8N]
IC48  FIN1101K8X  [SOP50P310X90-8N]
J1  (no value)  [TYCO_1469265-1]
J2  (no value)  [TYCO_6469183-1]  (parts A,B,C of 3)
J3  SMA  [HUBER-SUHNER_85_SMA-50-0-101/111_NE]
J6  (no value)  [TYCO_6469183-1]  (parts A,B,C of 3)
L3  390R@100MHz  [INDC1608X95N]
L4  390R@100MHz  [INDC1608X95N]
R23  5k1  [RESC1608X55N]
R24  5k1  [RESC1608X55N]
R25  5k1  [RESC1608X55N]
R26  5k1  [RESC1608X55N]
R27  5k1  [RESC1608X55N]
R33  100  [RESC1608X55N]
R34  100  [RESC1608X55N]
R35  100  [RESC1608X55N]
R36  100  [RESC1608X55N]
R37  10k  [RESC1005X40N]
R211  49R9  [RESC1005X40N]

### Ports
CLK_IN_SEL (out), FPGA_CLK1 (harness CLOCK_DIFF), FPGA_CLK2 (harness CLOCK_DIFF), INT (in), OE (out), REG_CLKn (out), REG_DINn (out), REG_OEn (out), REG_OUT (in), REG_PL (out), REG_STRn (out), SCL (bidir), SDA (bidir), SFP_CFG_SCL (bidir), SFP_CFG_SDA (bidir), SFP_PORT1 (harness SFP_PORT), SFP_PORT2 (harness SFP_PORT), SFP_PORT3 (harness SFP_PORT), SFP_PORT4 (harness SFP_PORT), SFP_PORT5 (harness SFP_PORT), SFP_PORT6 (harness SFP_PORT), SFP_PORT7 (harness SFP_PORT), SFP_PORT8 (harness SFP_PORT), SYNC_CLK (harness CLOCK_DIFF)

### Harnesses
SFP_PORT: SFPRX_P, SFPRX_N, SFPTX_P, SFPTX_N
CLOCK_DIFF: CLOCK_P, CLOCK_N

### Nets
GND: C16.2 C17.2 C19.1 C29.2 C30.2 C31.2 IC17.2(GND) IC48.2(GND) IC48.4(GND) J1.1 J2.bG1 J2.bG2 J2.bG3 J2.bG4 J2.bG5 J2.bG6 J2.bG7 J2.bG8 J2.bG9 J2.bG10 J2.dG1 J2.dG2 J2.dG3 J2.dG4 J2.dG5 J2.dG6 J2.dG7 J2.dG8 J2.dG9 J2.dG10 J2.fG1 J2.fG2 J2.fG3 J2.fG4 J2.fG5 J2.fG6 J2.fG7 J2.fG8 J2.fG9 J2.fG10 J3.2 J6.bG1 J6.bG2 J6.bG3 J6.bG4 J6.bG5 J6.bG6 J6.bG7 J6.bG8 J6.bG9 J6.bG10 J6.c1 J6.dG1 J6.dG2 J6.dG3 J6.dG4 J6.dG5 J6.dG6 J6.dG7 J6.dG8 J6.dG9 J6.dG10 J6.fG1 J6.fG2 J6.fG3 J6.fG4 J6.fG5 J6.fG6 J6.fG7 J6.fG8 J6.fG9 J6.fG10 R26.1 R211.2
P2V5: L4.2
P3V3: C17.1 C30.1 IC17.7(Vccb) IC48.7(VCC) L3.2 R25.1 R27.2
P3V3MP: J6.c2
P12V: F1.2
CLK_EXT_N: IC48.5(~{Q}) J6.b3
CLK_EXT_P: IC48.6(Q) J6.a3
FPGA_CLK1_N: J2.b5 ; port FPGA_CLK1.CLOCK_N
FPGA_CLK1_P: J2.a5 ; port FPGA_CLK1.CLOCK_P
FPGA_CLK2_N: J2.b9 ; port FPGA_CLK2.CLOCK_N
FPGA_CLK2_P: J2.a9 ; port FPGA_CLK2.CLOCK_P
RTM_IO0: J6.c5 ; port INT
RTM_IO1: J6.c6 ; port REG_OUT
RTM_IO2: J6.c7 ; port REG_OEn
RTM_IO3: J6.c8 ; port REG_CLKn
RTM_IO4: J6.c9 ; port REG_STRn
RTM_IO5: J6.c10 ; port REG_DINn
RTM_IO6: J2.a1 ; port REG_PL
RTM_IO7: J2.a2
RTM_IO8: J2.c1 ; port CLK_IN_SEL
RTM_IO9: J2.c2 ; port OE
RTM_IO10: IC17.4(A2) J2.e1
RTM_IO11: IC17.5(A1) J2.e2
RTM_IO12: J6.a7
RTM_LVD0_N: J6.f5
RTM_LVD0_P: J6.e5
RTM_LVD1_N: J6.f6
RTM_LVD1_P: J6.e6
RTM_LVD2_N: J6.f7
RTM_LVD2_P: J6.e7
RTM_LVD3_N: J6.f8
RTM_LVD3_P: J6.e8
RTM_LVD4_N: J6.f9
RTM_LVD4_P: J6.e9
RTM_LVD5_N: J6.f10
RTM_LVD5_P: J6.e10
RTM_LVD6_N: J6.b5
RTM_LVD6_P: J6.a5
RTM_LVD7_N: J6.b6
RTM_LVD7_P: J6.a6
SFP1RX_N: J2.d10 ; port SFP_PORT1.SFPRX_N
SFP1RX_P: J2.c10 ; port SFP_PORT1.SFPRX_P
SFP1TX_N: J2.f10 ; port SFP_PORT1.SFPTX_N
SFP1TX_P: J2.e10 ; port SFP_PORT1.SFPTX_P
SFP2RX_N: J2.d9 ; port SFP_PORT2.SFPRX_N
SFP2RX_P: J2.c9 ; port SFP_PORT2.SFPRX_P
SFP2TX_N: J2.f9 ; port SFP_PORT2.SFPTX_N
SFP2TX_P: J2.e9 ; port SFP_PORT2.SFPTX_P
SFP3RX_N: J2.d8 ; port SFP_PORT3.SFPRX_N
SFP3RX_P: J2.c8 ; port SFP_PORT3.SFPRX_P
SFP3TX_N: J2.f8 ; port SFP_PORT3.SFPTX_N
SFP3TX_P: J2.e8 ; port SFP_PORT3.SFPTX_P
SFP4RX_N: J2.d7 ; port SFP_PORT4.SFPRX_N
SFP4RX_P: J2.c7 ; port SFP_PORT4.SFPRX_P
SFP4TX_N: J2.f7 ; port SFP_PORT4.SFPTX_N
SFP4TX_P: J2.e7 ; port SFP_PORT4.SFPTX_P
SFP5RX_N: J2.d6 ; port SFP_PORT5.SFPRX_N
SFP5RX_P: J2.c6 ; port SFP_PORT5.SFPRX_P
SFP5TX_N: J2.f6 ; port SFP_PORT5.SFPTX_N
SFP5TX_P: J2.e6 ; port SFP_PORT5.SFPTX_P
SFP6RX_N: J2.d5 ; port SFP_PORT6.SFPRX_N
SFP6RX_P: J2.c5 ; port SFP_PORT6.SFPRX_P
SFP6TX_N: J2.f5 ; port SFP_PORT6.SFPTX_N
SFP6TX_P: J2.e5 ; port SFP_PORT6.SFPTX_P
SFP7RX_N: J2.d4 ; port SFP_PORT7.SFPRX_N
SFP7RX_P: J2.c4 ; port SFP_PORT7.SFPRX_P
SFP7TX_N: J2.f4 ; port SFP_PORT7.SFPTX_N
SFP7TX_P: J2.e4 ; port SFP_PORT7.SFPTX_P
SFP8RX_N: J2.d3 ; port SFP_PORT8.SFPRX_N
SFP8RX_P: J2.c3 ; port SFP_PORT8.SFPRX_P
SFP8TX_N: J2.f3 ; port SFP_PORT8.SFPTX_N
SFP8TX_P: J2.e3 ; port SFP_PORT8.SFPTX_P
SYNC_CLK_N: J6.d3 ; port SYNC_CLK.CLOCK_N
SYNC_CLK_P: J6.c3 ; port SYNC_CLK.CLOCK_P
NetC16_1: C16.1 R23.1 R24.1 R25.2 R26.2
NetC18_1: C18.1 J3.1 R211.1
NetC18_2: C18.2 IC48.8(IN) R23.2
NetC19_2: C19.2 IC48.1(IN) R24.2
NetC29_1: C29.1 C31.1 IC17.3(Vcca) L3.1 L4.1 R37.1
NetF1_1: F1.1 J6.a1 J6.a2 J6.b1 J6.b2
NetIC12_1: J6.d1 ; port SDA
NetIC12_2: J6.d2 ; port SCL
NetIC17_1: IC17.1(B2) ; port SFP_CFG_SCL
NetIC17_6: IC17.6(OE) R37.2
NetIC17_8: IC17.8(B1) ; port SFP_CFG_SDA
NetIC48_3: IC48.3(EN) R27.1
NetJ6_a4: J6.a4 R33.2
NetJ6_b4: J6.b4 R33.1
NetJ6_c4: J6.c4 R34.2
NetJ6_d4: J6.d4 R34.1
NetJ6_e2: J6.e2 J6.f1
NetJ6_e3: J6.e3 R36.2
NetJ6_e4: J6.e4 R35.2
NetJ6_f3: J6.f3 R36.1
NetJ6_f4: J6.f4 R35.1

Not connected (* = marked no-connect by the designer): J2 a3 a4 a6 a7 a8 a10 b1 b2 b3 b4 b6 b7 b8 b10 d1 d2 f1 f2; J6 a8 a9 a10 b7 b8 b9 b10 d5 d6 d7 d8 d9 d10 e1 f2

### Layout directives
differential pair: CLK_EXT_N, CLK_EXT_P, FPGA_CLK1_N, FPGA_CLK1_P, FPGA_CLK2_N, FPGA_CLK2_P, SYNC_CLK_N, SYNC_CLK_P

### Notes on the sheet
- (near L3) I2C voltage option
- R211, R23, R24 powinno byc terminacja do Z0 linii wejsciowej + (szerokosc 8 mil)
  tylko dlaczego ma byc podwojna terminacja?
  wg mnie R211 powinno byc opcjonalne
- (near J2) FPGA_CLK sa AMC_INPUT OK
- Ad 1. Poprawione.
  Ad 2. Poprawione.
- (near J2) LVCMOS or OC outputs needs on the µRTM a power supply voltage adjustment mechanism provided by the management.
- Poprawione
- if a µRTM do not support a GTPx_CLK_IN signal it should be open on the µRTM side.
  If a µRTM do not support a GTPx_CLK_OUT signal it should be terminated on the µRTM side.
  etc...
  strona 7 z dokuemtu:
  Zone 3 Pin Assignment Recommendation for Analog Applications for AMC/RTM Boards in the MTCA.4 standard (Release Rev.A.3 - 19/03/2013 approved by the BoF Group 1)
- Doda³em rezystory 100R przy ab4, cd4, ef3 i ef4 z³¹cza J6
- SFPRX - SFP MODULE transmitter, direction from SFP MODULE to HOST
  SFPTX - SFP MODULE reciver, direction  from HOST to SFP MODULE
- (near J6) 1) A3 powinno byc +
  2) zrodlo CLK_EXT powinno typowo byc na AMC
  The signal (AMC_CLK1+,AMC_CLK1-) provides typically a clock from the AMC to the µRTM
  jest plyta
  XFEL_DAMC2_TECHNICAL-MANUAL_17-Feb-2011_4
  i tam zrodlo jest rowniez na AMC
  czyli trzeba przepiac do cd3 - ab3
- GTPn_RXy (kierunek uRTM to AMC) sa podlaczone do SFPnTXow (kierunek uRTM to SFP module)
  czyli input do input'a
  Txy analogiocznie
  prosze zerknac na kierunki oznaczone w tabeli 6 dla d1.3
  http://mtca.desy.de/resources/zone_3_recommendation/index_eng.html
- RX - AMC RX, AMC input (CML)
  TX - AMC TX, AMC output (CML)
- Project/Equipment
- Document
- uTCA RTM 8 SFP+
- Designer
- Drawn by
- Check.by
- Copyright Creotech Instruments SA 2014.
  This documentation describes Open Hardware and is licensed under the CERN OHL v.1.1. You may redistribute and modify this documentation under the terms of the CERN OHL v.1.1. (http://ohwr.org/CERNOHL). This documentation is distributed WITHOUT ANY EXPRESS OR IMPLIED WARRANTY, INCLUDING OF MERCHANTABILITY, SATISFACTORY QUALITY AND FITNESS FOR A PARTICULAR PURPOSE. Please see the CERN OHL v.1.1 for applicable conditions.
- Creotech Instruments S.A.
- File
- Last Mod.
- Print Date
- Sheet
- Size
- A3
- of
- Rev
- (in symbol R0402_10K_1%_0.0625W_100PPM) 1%
- (in symbol R0402_49R9_1%_0.0625W_100PPM) 1%
- (in symbol R0603_5K1_1%_0.1W_100PPM) 1%
- (in symbol R0603_100R_1%_0.1W_100PPM) 1%
- (in symbol TXS0102DCTT) VCCA; VCCB

### Library data of the parts
C16-C19 = CC0402_100NF_16V_10%_X7R: as C5 on sheet Clock_Distribution; Part Number: CC0402_100NF_16V_10%_X7R; Component Kind: Standard; Component Type: Standard; Pin Count: 2; Value: 100nF; Status: Not Recommended; Manufacturer Part Number: CC0402_100NF_16V_10%_X7R; Case: 0402; Mounted: Yes; Socket: No; SMD: Yes; Manufacturer1 Example: PHYCOMP; Manufacturer1 ComponentHeight: 0.55mm; HelpURL: \\cern.ch\dfs\Applications\Altium\Datasheets\CC0402_X7R_PHYCOMP.pdf; Author: CERN DEM JLC; CreateDate: 12/3/2007; LatestRevisionDate: 12/3/2007
C29-C31 = CC0201_100NF_6.3V_10%_X5R: as C391 on sheet Clock_Distribution; Part Number: CC0201_100NF_6.3V_10%_X5R; Component Kind: Standard; Component Type: Standard; Pin Count: 2; Value: 100nF; Status: Not Recommended; Manufacturer Part Number: CC0201_100NF_6.3V_10%_X5R; Case: 0201; Mounted: Yes; Socket: No; SMD: Yes; Manufacturer1 Example: AVX; Manufacturer1 ComponentHeight: 0.33mm; HelpURL: \\cern.ch\dfs\Applications\Altium\Datasheets\CC0201_X5R_AVX.pdf; Author: CERN DEM JLC; CreateDate: 2007-12-03; LatestRevisionDate: 2007-12-03
F1 = FUSR_TYCO_SMD150F-2: Fuse; Part Description: PolySwitch® PTC Overcurrent Protection Device; Manufacturer: TYCO ELECTRONICS; Table: Fuses; Part Number: FUSR_TYCO_SMD150F-2; Component Kind: Standard; Component Type: Standard; Pin Count: 2; PackageDescription: PolySwitch, 2-Leads, Body 8.7x6.35mm Nominal; Family: Fuses Resettable; Mounted: Yes; Socket: No; SMD: Yes; Value: 1.5A-15V; Manufacturer Part Number: SMD150F-2; ComponentHeight: 3mm; HelpURL: \\cern.ch\dfs\Applications\Altium\Datasheets\FUSR_TYCO_SMD150F-2.pdf; Author: CERN DEM JLC; CreateDate: 2010-03-17; LatestRevisionDate: 2010-03-17
IC17 = TXS0102DCTT: 2-Bit Bidirectionnal Voltage-Level Translator for Open-Drain And Push-Pull Applications; Manufacturer: TEXAS INSTRUMENTS; PressFit: No; Bonding: No; Part Number: TXS0102DCTT; Component Kind: Standard; Component Type: Standard; Device: TXS0102DCTT; PackageDescription: SOP, 0.65mm, Pitch; 8 Pin, 2.80mm W X 2.95mm L X 1.30mm H Body, PC Medium Density; Part Description: 2-Bit Bidirectionnal Voltage-Level Translator for Open-Drain And Push-Pull Applications; Manufacturer Part Number: TXS0102DCTT; Pin Count: 8; Case: SSOP8; Mounted: Yes; Socket: No; SMD: Yes; Sense: No; ComponentHeight: 1.3mm; Author: CERN DEM JLC; HelpURL: \\cern.ch\dfs\Applications\Altium\Datasheets\TXS0102DCTT.pdf; CreateDate: 04/12/2013; LatestRevisionDate: 04/12/2013
IC48 = FIN1101K8X: LVDS Single Port High Speed Repeater; Manufacturer: Fairchild; PressFit: No; Bonding: No; Part Number: FIN1101K8X; Component Kind: Standard; Component Type: Standard; Device: FIN1101K8X; PackageDescription: SOP, 0.50mm pitch; 8 pin, 2.30mm W X 2.00mm L X 0.90mm H body, PC Medium Density; Part Description: LVDS Single Port High Speed Repeater; Manufacturer Part Number: FIN1101K8X; Pin Count: 8; Case: TSSOP8; Mounted: Yes; Socket: No; SMD: Yes; Sense: No; ComponentHeight: 0.9mm; Author: LNLS DIG GBMB; CreateDate: 04/02/2017; LatestRevisionDate: 04/02/2017
J1 = TYCO_1469265-1: Single Pin Male; Part Description: Universal Right Angle Male Power Module Guide (keyed); Manufacturer: TYCO ELECTRONICS; PressFit: No; Part Number: TYCO_1469265-1; Component Kind: Standard; Component Type: Standard; Pin Count: 1; Mounted: Yes; Socket: No; SMD: No; Sense: No; Status: None; Manufacturer Part Number: 1469265-1; ComponentHeight: 9.78mm; HelpURL: \\cern.ch\dfs\Applications\Altium\Datasheets\TYCO_1469265-1.pdf; Author: CERN DEM JLC; CreateDate: 28/08/2013; LatestRevisionDate: 28/08/2013
J2 J6 = TYCO_6469183-1: Connector 60 ATCA Male 30 Pairs (60 Signals) + 3x10 Ground; Manufacturer: TYCO ELECTRONICS; Part Description: 60 Positions, Pitch 2.5mm,  Advanced TCA, Z-PACK HM-Zd Right Angle Press Fit Header; Part Number: TYCO_6469183-1; Author: CERN DEM JLC; ComponentHeight: 13.31mm; Component Type: Standard; CreateDate: 28/08/2013; Family: Advanced TCA; HelpURL: \\cern.ch\dfs\Applications\Altium\Datasheets\TYCO_6469183-1.pdf; LatestRevisionDate: 28/08/2013; Manufacturer Part Number: 6469183-1; Mounted: Yes; Pin Count: 90; PressFit: Yes; Sense: No; SMD: No; Socket: No; Status: None
J3 = HUBER-SUHNER_85_SMA-50-0-101/111_NE: as J4 on sheet Clock_Distribution; Part Number: HUBER-SUHNER_85_SMA-50-0-101/111_NE; Component Kind: Standard; Component Type: Standard; Footprint: HUBER-SUHNER_85 SMA-50-0-101/111_NE; Pin Count: 2; Family: SMA; Mounted: Yes; Socket: No; SMD: No; Sense: No; Status: None; Manufacturer Part Number: 85_SMA-50-0-101/111_NE; ComponentHeight: 9.6mm; HelpURL: \\cern.ch\dfs\Applications\Altium\Datasheets\HUBER-SUHNER_85_SMA-50-0-101-111_NE.pdf; Author: CERN DEM JLC; CreateDate: 20/04/2010; LatestRevisionDate: 06/11/2014
L3 L4 = IND0603_TDK_MPZ1608R391A: as L19 on sheet Clock_Distribution; Part Number: IND0603_TDK_MPZ1608R391A; Component Kind: Standard; Component Type: Standard; Pin Count: 2; Value: 390R@100MHz; Status: None; Manufacturer Part Number: MPZ1608R391A; Case: 0603; Mounted: Yes; Socket: No; SMD: Yes; ComponentHeight: 0.95mm; HelpURL: \\cern.ch\dfs\Applications\Altium\Datasheets\IND0603_TDK_MPZ1608.pdf; Author: CERN DEM JLC; CreateDate: 2009-12-02; LatestRevisionDate: 2009-12-02
R23-R27 = R0603_5K1_1%_0.1W_100PPM: as R246 on sheet PWR; Part Number: R0603_5K1_1%_0.1W_100PPM; Component Kind: Standard; Component Type: Standard; Pin Count: 2; Value: 5k1; Status: Preferred; Tolerance: ±1%; Manufacturer Part Number: R0603_5K1_1%_0.1W_100PPM; Case: 0603; Mounted: Yes; Socket: No; SMD: Yes; Manufacturer1 Example: NIC COMPONENT; Manufacturer1 ComponentHeight: 0.55mm; HelpURL: \\cern.ch\dfs\Applications\Altium\Datasheets\R0603_NIC_NRC.pdf; Author: CERN DEM JLC; CreateDate: 03/12/2007; LatestRevisionDate: 13/03/2008
R33-R36 = R0603_100R_1%_0.1W_100PPM: Resistor - 1%; Part Description: General Purpose Thick Film Chip Resistor; Manufacturer: GENERIC; Manufacturer1 Part Number: NRC06F4700TRF; Power: 0.1W; TC: ±100ppm/°C; Part Number: R0603_100R_1%_0.1W_100PPM; Component Kind: Standard; Component Type: Standard; Pin Count: 2; Value: 100; Status: Preferred; Tolerance: ±1%; Manufacturer Part Number: R0603_100R_1%_0.1W_100PPM; Case: 0603; Mounted: Yes; Socket: No; SMD: Yes; Manufacturer1 Example: NIC COMPONENT; Manufacturer1 ComponentHeight: 0.55mm; HelpURL: \\cern.ch\dfs\Applications\Altium\Datasheets\R0603_NIC_NRC.pdf; Author: CERN DEM JLC; CreateDate: 03/12/2007; LatestRevisionDate: 13/03/2008; Sense: No
R37 = R0402_10K_1%_0.0625W_100PPM: as R311 on sheet Clock_Distribution; Part Number: R0402_10K_1%_0.0625W_100PPM; Component Kind: Standard; Component Type: Standard; Pin Count: 2; Value: 10k; Status: Not recommended; Power: 0.0625W; Tolerance: ±1%; Manufacturer Part Number: R0402_10K_1%_0.0625W_100PPM; Case: 0402; Mounted: Yes; Socket: No; SMD: Yes; Manufacturer1 Example: YAGEO PHYCOMP; Manufacturer1 ComponentHeight: 0.4mm; HelpURL: \\cern.ch\dfs\Applications\Altium\Datasheets\R0402_Phycomp_RC0402.pdf; Author: CERN DEM JLC; CreateDate: 2007-12-03; LatestRevisionDate: 2012-10-17
R211 = R0402_49R9_1%_0.0625W_100PPM: Resistor - 1%; Part Description: General Purpose Thick Film Chip Resistor; Manufacturer: GENERIC; Manufacturer1 Part Number: 232270674999L or RC0402FR-0749R9L; TC: ±100ppm/°C; Part Number: R0402_49R9_1%_0.0625W_100PPM; Component Kind: Standard; Component Type: Standard; Pin Count: 2; Value: 49R9; Status: Not recommended; Power: 0.0625W; Tolerance: ±1%; Manufacturer Part Number: R0402_49R9_1%_0.0625W_100PPM; Case: 0402; Mounted: Yes; Sense: No; Socket: No; SMD: Yes; Manufacturer1 Example: YAGEO PHYCOMP; Manufacturer1 ComponentHeight: 0.4mm; HelpURL: \\cern.ch\dfs\Applications\Altium\Datasheets\R0402_Phycomp_RC0402.pdf; Author: CERN DEM JLC; CreateDate: 24/10/2012; LatestRevisionDate: 24/10/2012